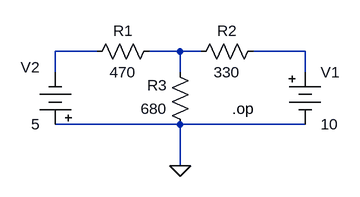
[diagram p0: schematic KVL.asc]
KVL.asc, the LTspice schematic file:
Version 4
SHEET 1 880 680
WIRE -272 80 -336 80
WIRE -144 80 -192 80
WIRE -112 80 -144 80
WIRE 48 80 -32 80
WIRE -336 112 -336 80
WIRE -144 112 -144 80
WIRE 48 112 48 80
WIRE -144 192 -336 192
WIRE 48 192 -144 192
WIRE -144 256 -144 192
FLAG -144 256 0
DATAFLAG 48 80 "$-V(N002)"
DATAFLAG -144 80 ""
DATAFLAG -144 80 ""
DATAFLAG -336 80 "$-V(N002)"
SYMBOL Misc\\battery 48 96 R0
WINDOW 123 0 0 Left 0
WINDOW 39 0 0 Left 0
SYMATTR InstName V1
SYMATTR Value 10
SYMBOL Misc\\battery -336 208 R180
WINDOW 0 24 104 Left 2
WINDOW 3 24 16 Left 2
WINDOW 123 0 0 Left 0
WINDOW 39 0 0 Left 0
SYMATTR InstName V2
SYMATTR Value 5
SYMBOL res -176 64 R90
WINDOW 0 0 56 VBottom 2
WINDOW 3 32 56 VTop 2
SYMATTR InstName R1
SYMATTR Value 470
SYMBOL res -16 64 R90
WINDOW 0 0 56 VBottom 2
WINDOW 3 32 56 VTop 2
SYMATTR InstName R2
SYMATTR Value 330
SYMBOL res -128 208 R180
WINDOW 0 36 76 Left 2
WINDOW 3 36 40 Left 2
SYMATTR InstName R3
SYMATTR Value 680
TEXT -64 168 Left 2 !.op

The netlist it stands for:
* KVL.asc
V1 N003 0 10
V2 0 N001 5
R1 N002 N001 470
R2 N003 N002 330
R3 0 N002 680
.op
.backanno
.end